# Altium schematic sheet Reid Orthotic v2 Charger.SchDoc: Reid Orthotic Charger
size A3; DrawnBy: Alex Gilmour; SheetNumber: 1; SheetTotal: 1; PageSetup: Record=PageOptions|CenterHorizontal=True|CenterVertical=True|PrintScale=0.73|XCorrection=1.00|YCorrection=1.00|PrintKind=0|BorderSize=5000000|LeftOffset=0|BottomOffset=0|Orientation=2|PaperLength=1000|PaperWidth=1000|Scale=100|PaperSource=7|PrintQuality=-3|MediaType=1|DitherType=10|PrintScaleMode=1|PaperKind=A4|PaperIndex=9
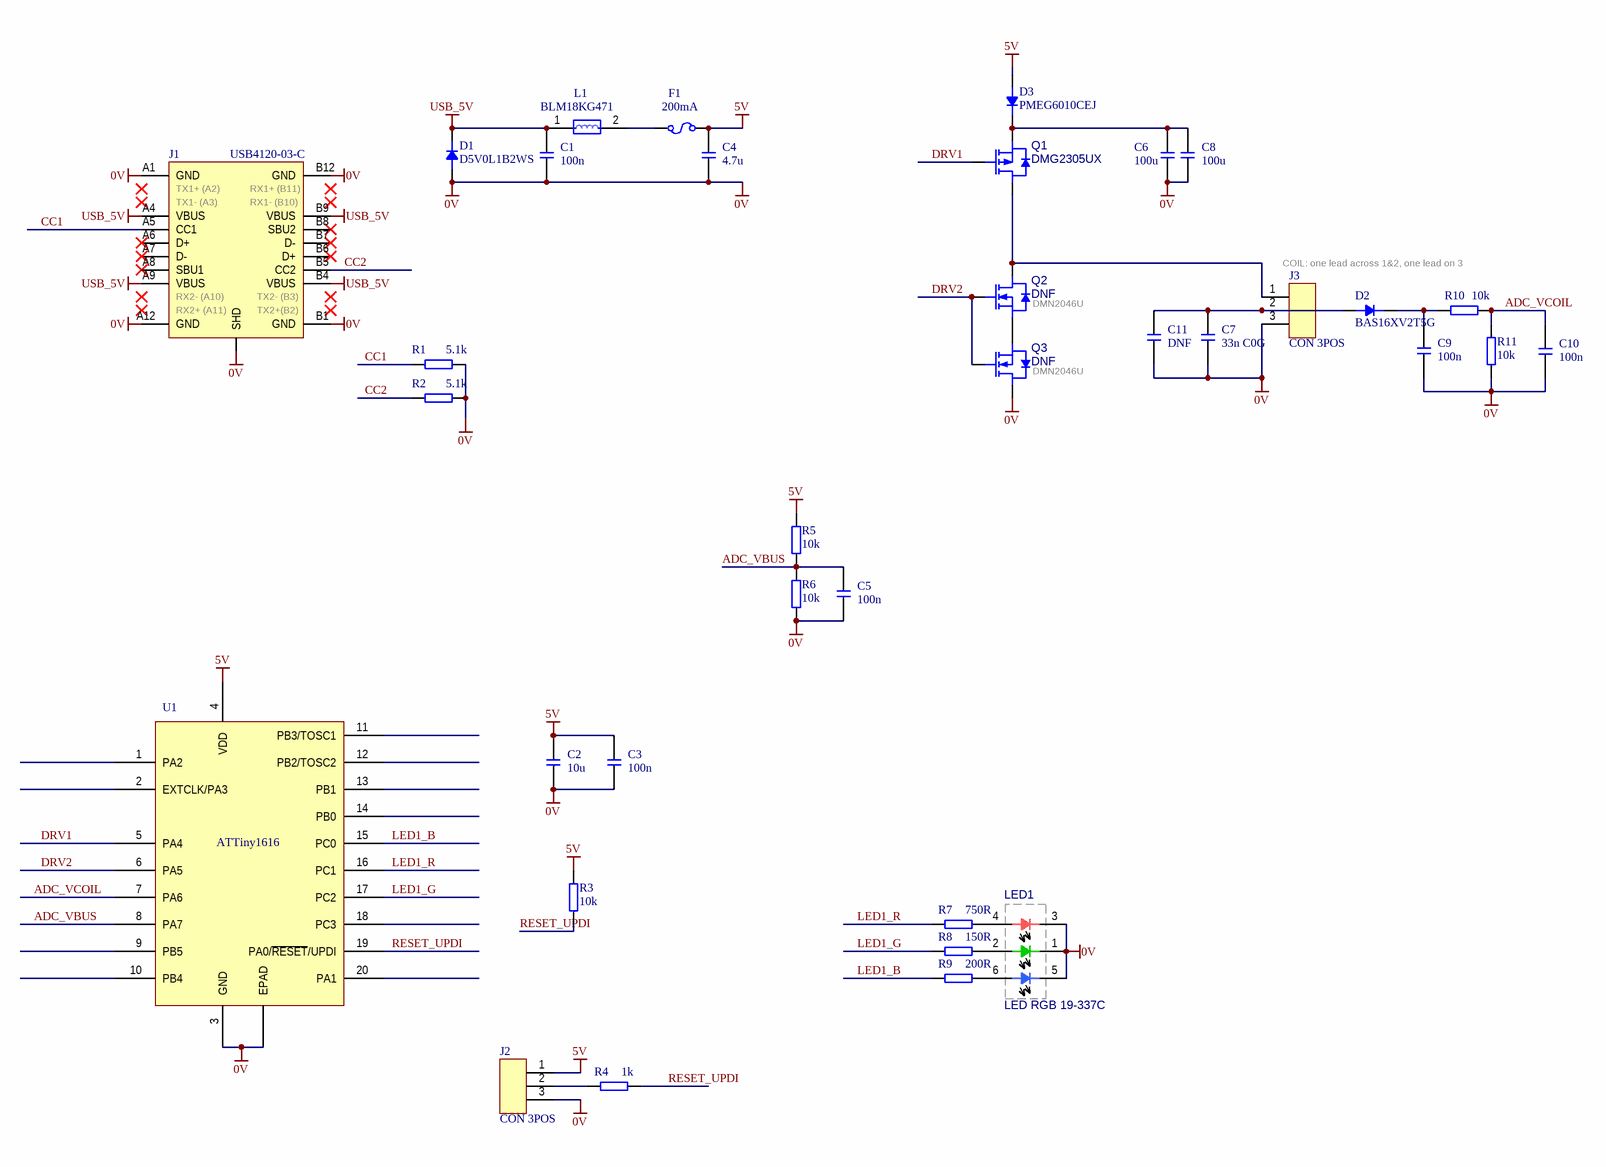
[diagram p0: Reid Orthotic v2 Charger.SchDoc]

## Parts
C1  100n  [0402 CAP HD]
C2  10u  [0603 CAP HD]
C3  100n  [0402 CAP HD]
C4  4.7u  [0603 CAP HD]
C5  100n  [0402 CAP HD]
C6  100u  [0805 CAP]
C7  33n C0G  [0805 CAP]
C8  100u  [0805 CAP]
C9  100n  [0402 CAP HD]
C10  100n  [0402 CAP HD]
C11  DNF  [0805 CAP]
D1  D5V0L1B2WS  [SOD-323]
D2  BAS16XV2T5G  [SOD-523]
D3  PMEG6010CEJ  [SOD-323]
F1  200mA  [0603 FUSE]
J1  USB4120-03-C  [USB4120-03-C]
J2  CON 3POS  [CON HEADER 3POS 2mm]
J3  CON 3POS  [CON HEADER 3POS 2mm]
L1  BLM18KG471  [0603 HD]
LED1  LED RGB 19-337C  [19-337C-RSBHGHC-A88-4T]
Q1  DMG2305UX  [SOT23-3]
Q2  DNF  [SOT23-3]
Q3  DNF  [SOT23-3]
R1  5.1k  [0402 RES HD]
R2  5.1k  [0402 RES HD]
R3  10k  [0402 RES HD]
R4  1k  [0402 RES HD]
R5  10k  [0402 RES HD]
R6  10k  [0402 RES HD]
R7  750R  [0402 RES HD]
R8  150R  [0402 RES HD]
R9  200R  [0402 RES HD]
R10  10k  [0402 RES HD]
R11  10k  [0402 RES HD]
U1  ATTiny1616  [20-Pin VQFN]

## Nets
0V: C1.2 C2.2 C3.2 C4.1 C5.2 C6.1 C7.2 C8.1 C9.2 C10.2 C11.2 D1.A J1.A1(GND) J1.A12(GND) J1.B1(GND) J1.B12(GND) J1.SHD J2.3 J3.3 LED1.1(GRN_K) LED1.3(RED_K) LED1.5(BLU_K) Q3.3(D) R1.2 R2.2 R6.1 R11.1 U1.3(GND) U1.EPAD
5V: C2.1 C3.1 C4.2 D3.A F1.1 J2.1 R3.2 R5.2 U1.4(VDD)
USB_5V: C1.1 D1.K J1.A4(VBUS) J1.A9(VBUS) J1.B4(VBUS) J1.B9(VBUS) L1.1
ADC_VBUS: C5.1 R5.1 R6.2 U1.8(PA7)
ADC_VCOIL: C10.1 R10.1 R11.2 U1.7(PA6)
CC1: J1.A5(CC1) R1.1
CC2: J1.B5(CC2) R2.1
DRV1: Q1.1(G) U1.5(PA4)
DRV2: Q2.1(G) Q3.1(G) U1.6(PA5)
LED1_B: R9.2 U1.15(PC0)
LED1_G: R8.2 U1.17(PC2)
LED1_R: R7.2 U1.16(PC1)
RESET_UPDI: R3.1 R4.1 U1.19(PA0/~{RESET}/UPDI)
NetC6_2: C6.2 C8.2 D3.K Q1.2(S)
NetC7_1: C7.1 C11.1 D2.A J3.2
NetC9_1: C9.1 D2.K R10.2
NetF1_2: F1.2 L1.2
NetJ2_2: J2.2 R4.2
NetJ3_1: J3.1 Q1.3(D) Q2.3(D)
NetLED1_2: LED1.2(GRN_A) R8.1
NetLED1_4: LED1.4(RED_A) R7.1
NetLED1_6: LED1.6(BLU_A) R9.1
NetQ2_2: Q2.2(S) Q3.2(S)

Not connected (* = marked no-connect by the designer): J1 A6(D+)* A7(D-)* A8(SBU1)* B6(D+)* B7(D-)* B8(SBU2)*; U1 1(PA2) 2(EXTCLK/PA3) 9(PB5) 10(PB4) 11(PB3/TOSC1) 12(PB2/TOSC2) 13(PB1) 14(PB0) 18(PC3) 20(PA1)

## Notes on the sheet
- COIL: one lead across 1&2, one lead on 3
- (near Q2) DMN2046U
- (near Q3) DMN2046U
- A.B.N. 89 367 394 425
- Revision
- Drawn by
- Last updated
- Sheet
- of
- (in symbol USB C Connector (16+8)) TX1+ (A2); RX1+ (B11); TX1- (A3); RX1- (B10); RX2- (A10); TX2- (B3); RX2+ (A11); TX2+(B2)

## Library data of the parts
C1-C11 = Capacitor
D1-D3 = Diode
F1 = Fuse
J1 = USB C Connector (16+8)
L1 = BEAD
Q1 = MOSFET PCH
Q2 Q3 = MOSFET NCH
R1-R11 = Resistor
U1 = ATTiny1616: ATTiny1616/1617